# Altium schematic sheet FMC_DAC_125M_14B_16CHA.SchDoc: Shuttler
size 420 x 297 mm; Author: G.Kasprowicz; CompanyName: WUT ISE; DrawnBy: G.Kasprowicz; Organization: WUT ISE; Address1: PW ISE; Address2: Nowowiejska 15/19 00-665 Warsaw; Address3: gkasprow@gmail.com; DocumentNumber: 1; Revision: 2; SheetNumber: 1; SheetTotal: 10; ModifiedBy: -; CheckedDate: -; Title2: FMC DAC 125M 14B 16cha; DivGrp: WUT ISE; Designer: G.Kasprowicz; ModifiedDate: -; ProjectName: Sensor Box
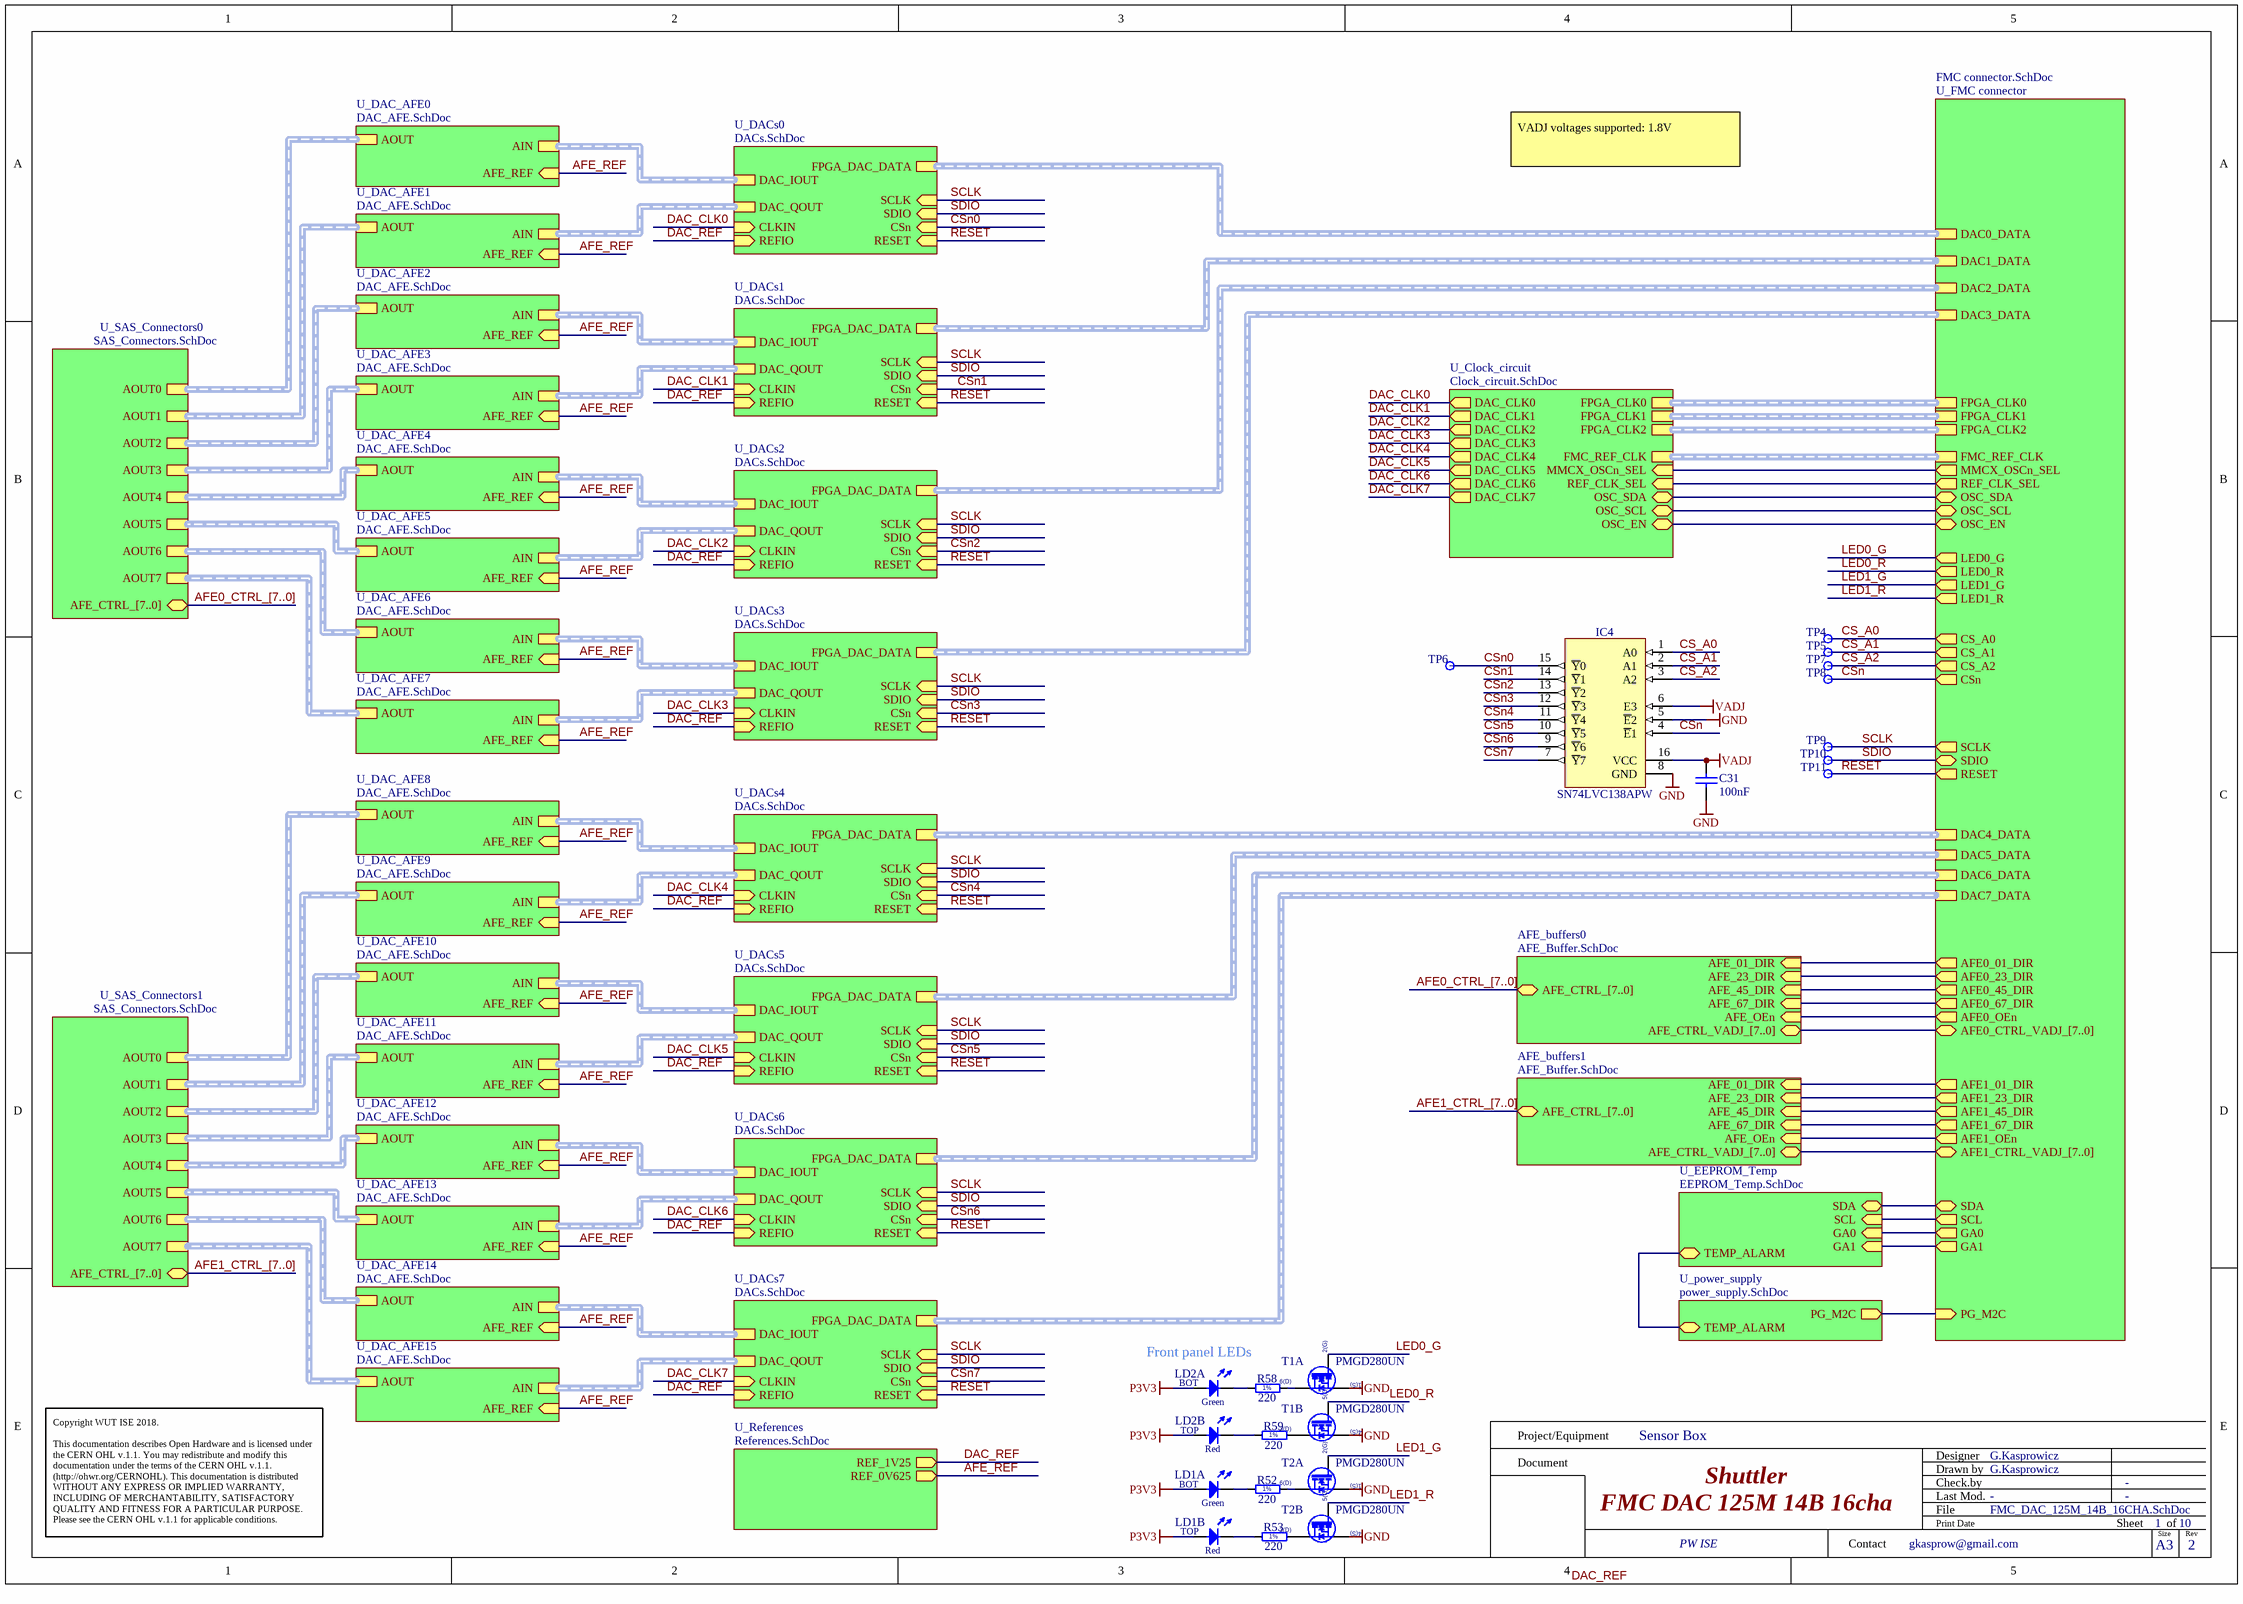
[diagram p0: FMC_DAC_125M_14B_16CHA.SchDoc]

## Parts
C31  100nF  [CAPC1005X55N]
IC4  SN74LVC138APW  [SOP65P640X110-16N]
LD1  Red/Green  [LED_DIALIGHT_571-0112F]  (value not drawn)  (parts A,B of 2)
LD2  Red/Green  [LED_DIALIGHT_571-0112F]  (value not drawn)  (parts A,B of 2)
R52  220  [RESC1608X55N]
R53  220  [RESC1608X55N]
R58  220  [RESC1608X55N]
R59  220  [RESC1608X55N]
T1  PMGD280UN  [SOT65P210X110-6N]  (parts A,B of 2)
T2  PMGD280UN  [SOT65P210X110-6N]  (parts A,B of 2)
TP4  Test Point  [TPS127]  (value not drawn)
TP5  Test Point  [TPS127]  (value not drawn)
TP6  Test Point  [TPS127]  (value not drawn)
TP7  Test Point  [TPS127]  (value not drawn)
TP8  Test Point  [TPS127]  (value not drawn)
TP9  Test Point  [TPS127]  (value not drawn)
TP10  Test Point  [TPS127]  (value not drawn)
TP11  Test Point  [TPS127]  (value not drawn)

## Sub-sheets
AFE_buffers0 = AFE_Buffer.SchDoc: AFE_CTRL_[7..0] (bidir), AFE_23_DIR (in), AFE_67_DIR (in), AFE_01_DIR (in), AFE_OEn (in), AFE_45_DIR (in), AFE_CTRL_VADJ_[7..0] (bidir)
AFE_buffers1 = AFE_Buffer.SchDoc: AFE_CTRL_[7..0] (bidir), AFE_23_DIR (in), AFE_67_DIR (in), AFE_01_DIR (in), AFE_OEn (in), AFE_45_DIR (in), AFE_CTRL_VADJ_[7..0] (bidir)
U_Clock_circuit = Clock_circuit.SchDoc: FPGA_CLK0 (harness DIFFCLK), FPGA_CLK1 (harness DIFFCLK), FPGA_CLK2 (harness DIFFCLK), DAC_CLK0 (out), DAC_CLK1 (out), DAC_CLK2 (out), DAC_CLK3 (out), DAC_CLK4 (out), DAC_CLK5 (out), DAC_CLK6 (out), DAC_CLK7 (out), OSC_SDA (bidir), OSC_SCL (bidir), OSC_EN (bidir), MMCX_OSCn_SEL (in), FMC_REF_CLK (harness DIFFCLK), REF_CLK_SEL (in)
U_DAC_AFE0 = DAC_AFE.SchDoc: AIN (harness DIFF), AOUT (harness DIFF), AFE_REF (in)
U_DAC_AFE1 = DAC_AFE.SchDoc: AIN (harness DIFF), AOUT (harness DIFF), AFE_REF (in)
U_DAC_AFE2 = DAC_AFE.SchDoc: AIN (harness DIFF), AOUT (harness DIFF), AFE_REF (in)
U_DAC_AFE3 = DAC_AFE.SchDoc: AIN (harness DIFF), AOUT (harness DIFF), AFE_REF (in)
U_DAC_AFE4 = DAC_AFE.SchDoc: AIN (harness DIFF), AOUT (harness DIFF), AFE_REF (in)
U_DAC_AFE5 = DAC_AFE.SchDoc: AIN (harness DIFF), AOUT (harness DIFF), AFE_REF (in)
U_DAC_AFE6 = DAC_AFE.SchDoc: AIN (harness DIFF), AOUT (harness DIFF), AFE_REF (in)
U_DAC_AFE7 = DAC_AFE.SchDoc: AIN (harness DIFF), AOUT (harness DIFF), AFE_REF (in)
U_DAC_AFE8 = DAC_AFE.SchDoc: AIN (harness DIFF), AOUT (harness DIFF), AFE_REF (in)
U_DAC_AFE9 = DAC_AFE.SchDoc: AIN (harness DIFF), AOUT (harness DIFF), AFE_REF (in)
U_DAC_AFE10 = DAC_AFE.SchDoc: AIN (harness DIFF), AOUT (harness DIFF), AFE_REF (in)
U_DAC_AFE11 = DAC_AFE.SchDoc: AIN (harness DIFF), AOUT (harness DIFF), AFE_REF (in)
U_DAC_AFE12 = DAC_AFE.SchDoc: AIN (harness DIFF), AOUT (harness DIFF), AFE_REF (in)
U_DAC_AFE13 = DAC_AFE.SchDoc: AIN (harness DIFF), AOUT (harness DIFF), AFE_REF (in)
U_DAC_AFE14 = DAC_AFE.SchDoc: AIN (harness DIFF), AOUT (harness DIFF), AFE_REF (in)
U_DAC_AFE15 = DAC_AFE.SchDoc: AIN (harness DIFF), AOUT (harness DIFF), AFE_REF (in)
U_DACs0 = DACs.SchDoc: FPGA_DAC_DATA (harness DAC_DATA_E), SCLK (in), SDIO (in), CSn (in), RESET (in), DAC_IOUT (harness DIFF), DAC_QOUT (harness DIFF), CLKIN (in), REFIO (in)
U_DACs1 = DACs.SchDoc: FPGA_DAC_DATA (harness DAC_DATA_E), SCLK (in), SDIO (in), CSn (in), RESET (in), DAC_IOUT (harness DIFF), DAC_QOUT (harness DIFF), CLKIN (in), REFIO (in)
U_DACs2 = DACs.SchDoc: FPGA_DAC_DATA (harness DAC_DATA_E), SCLK (in), SDIO (in), CSn (in), RESET (in), DAC_IOUT (harness DIFF), DAC_QOUT (harness DIFF), CLKIN (in), REFIO (in)
U_DACs3 = DACs.SchDoc: FPGA_DAC_DATA (harness DAC_DATA_E), SCLK (in), SDIO (in), CSn (in), RESET (in), DAC_IOUT (harness DIFF), DAC_QOUT (harness DIFF), CLKIN (in), REFIO (in)
U_DACs4 = DACs.SchDoc: FPGA_DAC_DATA (harness DAC_DATA_E), SCLK (in), SDIO (in), CSn (in), RESET (in), DAC_IOUT (harness DIFF), DAC_QOUT (harness DIFF), CLKIN (in), REFIO (in)
U_DACs5 = DACs.SchDoc: FPGA_DAC_DATA (harness DAC_DATA_E), SCLK (in), SDIO (in), CSn (in), RESET (in), DAC_IOUT (harness DIFF), DAC_QOUT (harness DIFF), CLKIN (in), REFIO (in)
U_DACs6 = DACs.SchDoc: FPGA_DAC_DATA (harness DAC_DATA_E), SCLK (in), SDIO (in), CSn (in), RESET (in), DAC_IOUT (harness DIFF), DAC_QOUT (harness DIFF), CLKIN (in), REFIO (in)
U_DACs7 = DACs.SchDoc: FPGA_DAC_DATA (harness DAC_DATA_E), SCLK (in), SDIO (in), CSn (in), RESET (in), DAC_IOUT (harness DIFF), DAC_QOUT (harness DIFF), CLKIN (in), REFIO (in)
U_EEPROM_Temp = EEPROM_Temp.SchDoc: SDA (bidir), SCL (in), GA0 (in), GA1 (in), TEMP_ALARM (bidir)
U_FMC connector = FMC connector.SchDoc: SDA (bidir), GA1 (out), GA0 (out), SCL (out), CS_A2 (out), CSn (out), CS_A0 (out), CS_A1 (out), SCLK (out), SDIO (bidir), RESET (out), DAC4_DATA (harness DAC_DATA_E), DAC5_DATA (harness DAC_DATA_E), DAC6_DATA (harness DAC_DATA_E), DAC7_DATA (harness DAC_DATA_E), DAC1_DATA (harness DAC_DATA_E), DAC2_DATA (harness DAC_DATA_E), DAC3_DATA (harness DAC_DATA_E), DAC0_DATA (harness DAC_DATA_E), FPGA_CLK0 (harness DIFF), FPGA_CLK1 (harness DIFF), FPGA_CLK2 (harness DIFF), FMC_REF_CLK (harness DIFF), MMCX_OSCn_SEL (out), REF_CLK_SEL (out), OSC_SDA (bidir), OSC_SCL (bidir), OSC_EN (bidir), AFE0_01_DIR (out), AFE0_23_DIR (out), AFE0_45_DIR (out), AFE0_67_DIR (out), AFE0_OEn (out), AFE0_CTRL_VADJ_[7..0] (bidir), AFE1_CTRL_VADJ_[7..0] (bidir), AFE1_01_DIR (out), AFE1_23_DIR (out), AFE1_45_DIR (out), AFE1_67_DIR (out), AFE1_OEn (out), PG_M2C (in), LED0_G (out), LED0_R (out), LED1_G (out), LED1_R (out)
U_power_supply = power_supply.SchDoc: PG_M2C (out), TEMP_ALARM (bidir)
U_References = References.SchDoc: REF_1V25 (out), REF_0V625 (out)
U_SAS_Connectors0 = SAS_Connectors.SchDoc: AOUT4 (harness DIFF), AOUT0 (harness DIFF), AOUT1 (harness DIFF), AOUT2 (harness DIFF), AOUT6 (harness DIFF), AOUT7 (harness DIFF), AFE_CTRL_[7..0] (bidir), AOUT3 (harness DIFF), AOUT5 (harness DIFF)
U_SAS_Connectors1 = SAS_Connectors.SchDoc: AOUT4 (harness DIFF), AOUT0 (harness DIFF), AOUT1 (harness DIFF), AOUT2 (harness DIFF), AOUT6 (harness DIFF), AOUT7 (harness DIFF), AOUT3 (harness DIFF), AOUT5 (harness DIFF), AFE_CTRL_[7..0] (bidir)

## Nets
GND: C31.1 IC4.5(~{E}2) IC4.8(GND) T1.1(S) T1.4(S) T2.1(S) T2.4(S)
P3V3: LD1.2(A) LD1.4(A) LD2.2(A) LD2.4(A)
VADJ: C31.2 IC4.6(E3) IC4.16(VCC)
AFE_REF: sheet U_DAC_AFE0/AFE_REF, sheet U_DAC_AFE1/AFE_REF, sheet U_DAC_AFE2/AFE_REF, sheet U_DAC_AFE3/AFE_REF, sheet U_DAC_AFE4/AFE_REF, sheet U_DAC_AFE5/AFE_REF, sheet U_DAC_AFE6/AFE_REF, sheet U_DAC_AFE7/AFE_REF, sheet U_DAC_AFE8/AFE_REF, sheet U_DAC_AFE9/AFE_REF, sheet U_DAC_AFE10/AFE_REF, sheet U_DAC_AFE11/AFE_REF, sheet U_DAC_AFE12/AFE_REF, sheet U_DAC_AFE13/AFE_REF, sheet U_DAC_AFE14/AFE_REF, sheet U_DAC_AFE15/AFE_REF, sheet U_References/REF_0V625
CS_A0: IC4.1(A0) TP4.1 ; sheet U_FMC connector/CS_A0
CS_A1: IC4.2(A1) TP5.1 ; sheet U_FMC connector/CS_A1
CS_A2: IC4.3(A2) TP7.1 ; sheet U_FMC connector/CS_A2
CSn: IC4.4(~{E}1) TP8.1 ; sheet U_FMC connector/CSn
CSn0: IC4.15(~{Y}0) TP6.1 ; sheet U_DACs0/CSn
CSn1: IC4.14(~{Y}1) ; sheet U_DACs1/CSn
CSn2: IC4.13(~{Y}2) ; sheet U_DACs2/CSn
CSn3: IC4.12(~{Y}3) ; sheet U_DACs3/CSn
CSn4: IC4.11(~{Y}4) ; sheet U_DACs4/CSn
CSn5: IC4.10(~{Y}5) ; sheet U_DACs5/CSn
CSn6: IC4.9(~{Y}6) ; sheet U_DACs6/CSn
CSn7: IC4.7(~{Y}7) ; sheet U_DACs7/CSn
DAC_CLK0: sheet U_DACs0/CLKIN, sheet U_Clock_circuit/DAC_CLK0
DAC_CLK1: sheet U_DACs1/CLKIN, sheet U_Clock_circuit/DAC_CLK1
DAC_CLK2: sheet U_DACs2/CLKIN, sheet U_Clock_circuit/DAC_CLK2
DAC_CLK3: sheet U_DACs3/CLKIN, sheet U_Clock_circuit/DAC_CLK3
DAC_CLK4: sheet U_DACs4/CLKIN, sheet U_Clock_circuit/DAC_CLK4
DAC_CLK5: sheet U_DACs5/CLKIN, sheet U_Clock_circuit/DAC_CLK5
DAC_CLK6: sheet U_DACs6/CLKIN, sheet U_Clock_circuit/DAC_CLK6
DAC_CLK7: sheet U_DACs7/CLKIN, sheet U_Clock_circuit/DAC_CLK7
DAC_REF: sheet U_DACs0/REFIO, sheet U_DACs1/REFIO, sheet U_DACs2/REFIO, sheet U_DACs3/REFIO, sheet U_DACs4/REFIO, sheet U_DACs5/REFIO, sheet U_DACs6/REFIO, sheet U_DACs7/REFIO, sheet U_References/REF_1V25
LED0_G: T1.2(G) ; sheet U_FMC connector/LED0_G
LED0_R: T1.5(G) ; sheet U_FMC connector/LED0_R
LED1_G: T2.2(G) ; sheet U_FMC connector/LED1_G
LED1_R: T2.5(G) ; sheet U_FMC connector/LED1_R
RESET: TP11.1 ; sheet U_FMC connector/RESET, sheet U_DACs0/RESET, sheet U_DACs1/RESET, sheet U_DACs2/RESET, sheet U_DACs3/RESET, sheet U_DACs4/RESET, sheet U_DACs5/RESET, sheet U_DACs6/RESET, sheet U_DACs7/RESET
SCLK: TP9.1 ; sheet U_FMC connector/SCLK, sheet U_DACs0/SCLK, sheet U_DACs1/SCLK, sheet U_DACs2/SCLK, sheet U_DACs3/SCLK, sheet U_DACs4/SCLK, sheet U_DACs5/SCLK, sheet U_DACs6/SCLK, sheet U_DACs7/SCLK
SDIO: TP10.1 ; sheet U_FMC connector/SDIO, sheet U_DACs0/SDIO, sheet U_DACs1/SDIO, sheet U_DACs2/SDIO, sheet U_DACs3/SDIO, sheet U_DACs4/SDIO, sheet U_DACs5/SDIO, sheet U_DACs6/SDIO, sheet U_DACs7/SDIO
NetLD1_1: LD1.1(C) R52.1
NetLD1_3: LD1.3(C) R53.1
NetLD2_1: LD2.1(C) R58.1
NetLD2_3: LD2.3(C) R59.1
NetR52_2: R52.2 T2.6(D)
NetR53_2: R53.2 T2.3(D)
NetR58_2: R58.2 T1.6(D)
NetR59_2: R59.2 T1.3(D)
(unnamed): sheet U_EEPROM_Temp/SDA, sheet U_FMC connector/SDA
(unnamed): sheet U_EEPROM_Temp/SCL, sheet U_FMC connector/SCL
(unnamed): sheet U_EEPROM_Temp/GA0, sheet U_FMC connector/GA0
(unnamed): sheet U_EEPROM_Temp/GA1, sheet U_FMC connector/GA1
(unnamed): sheet U_EEPROM_Temp/TEMP_ALARM, sheet U_power_supply/TEMP_ALARM
(unnamed): sheet U_FMC connector/MMCX_OSCn_SEL, sheet U_Clock_circuit/MMCX_OSCn_SEL
(unnamed): sheet U_FMC connector/REF_CLK_SEL, sheet U_Clock_circuit/REF_CLK_SEL
(unnamed): sheet U_FMC connector/OSC_SDA, sheet U_Clock_circuit/OSC_SDA
(unnamed): sheet U_FMC connector/OSC_SCL, sheet U_Clock_circuit/OSC_SCL
(unnamed): sheet U_FMC connector/OSC_EN, sheet U_Clock_circuit/OSC_EN
(unnamed): sheet U_FMC connector/AFE0_01_DIR, sheet AFE_buffers0/AFE_01_DIR
(unnamed): sheet U_FMC connector/AFE0_23_DIR, sheet AFE_buffers0/AFE_23_DIR
(unnamed): sheet U_FMC connector/AFE0_45_DIR, sheet AFE_buffers0/AFE_45_DIR
(unnamed): sheet U_FMC connector/AFE0_67_DIR, sheet AFE_buffers0/AFE_67_DIR
(unnamed): sheet U_FMC connector/AFE0_OEn, sheet AFE_buffers0/AFE_OEn
(unnamed): sheet U_FMC connector/AFE1_01_DIR, sheet AFE_buffers1/AFE_01_DIR
(unnamed): sheet U_FMC connector/AFE1_23_DIR, sheet AFE_buffers1/AFE_23_DIR
(unnamed): sheet U_FMC connector/AFE1_45_DIR, sheet AFE_buffers1/AFE_45_DIR
(unnamed): sheet U_FMC connector/AFE1_67_DIR, sheet AFE_buffers1/AFE_67_DIR
(unnamed): sheet U_FMC connector/AFE1_OEn, sheet AFE_buffers1/AFE_OEn
(unnamed): sheet U_FMC connector/PG_M2C, sheet U_power_supply/PG_M2C

## Buses and harness runs
bus AFE0_CTRL_[7..0] = sheet AFE_buffers0/AFE_CTRL_[7..0]
bus AFE0_CTRL_[7..0] = sheet U_SAS_Connectors0/AFE_CTRL_[7..0]
bus AFE1_CTRL_[7..0] = sheet AFE_buffers1/AFE_CTRL_[7..0]
bus AFE1_CTRL_[7..0] = sheet U_SAS_Connectors1/AFE_CTRL_[7..0]
bus sheet AFE_buffers0/AFE_CTRL_VADJ_[7..0] = sheet U_FMC connector/AFE0_CTRL_VADJ_[7..0]
bus sheet AFE_buffers1/AFE_CTRL_VADJ_[7..0] = sheet U_FMC connector/AFE1_CTRL_VADJ_[7..0]
harness sheet U_Clock_circuit/FMC_REF_CLK = sheet U_FMC connector/FMC_REF_CLK
harness sheet U_Clock_circuit/FPGA_CLK0 = sheet U_FMC connector/FPGA_CLK0
harness sheet U_Clock_circuit/FPGA_CLK1 = sheet U_FMC connector/FPGA_CLK1
harness sheet U_Clock_circuit/FPGA_CLK2 = sheet U_FMC connector/FPGA_CLK2
harness sheet U_DAC_AFE0/AIN = sheet U_DACs0/DAC_IOUT
harness sheet U_DAC_AFE0/AOUT = sheet U_SAS_Connectors0/AOUT0
harness sheet U_DAC_AFE1/AIN = sheet U_DACs0/DAC_QOUT
harness sheet U_DAC_AFE1/AOUT = sheet U_SAS_Connectors0/AOUT1
harness sheet U_DAC_AFE2/AIN = sheet U_DACs1/DAC_IOUT
harness sheet U_DAC_AFE2/AOUT = sheet U_SAS_Connectors0/AOUT2
harness sheet U_DAC_AFE3/AIN = sheet U_DACs1/DAC_QOUT
harness sheet U_DAC_AFE3/AOUT = sheet U_SAS_Connectors0/AOUT3
harness sheet U_DAC_AFE4/AIN = sheet U_DACs2/DAC_IOUT
harness sheet U_DAC_AFE4/AOUT = sheet U_SAS_Connectors0/AOUT4
harness sheet U_DAC_AFE5/AIN = sheet U_DACs2/DAC_QOUT
harness sheet U_DAC_AFE5/AOUT = sheet U_SAS_Connectors0/AOUT5
harness sheet U_DAC_AFE6/AIN = sheet U_DACs3/DAC_IOUT
harness sheet U_DAC_AFE6/AOUT = sheet U_SAS_Connectors0/AOUT6
harness sheet U_DAC_AFE7/AIN = sheet U_DACs3/DAC_QOUT
harness sheet U_DAC_AFE7/AOUT = sheet U_SAS_Connectors0/AOUT7
harness sheet U_DAC_AFE8/AIN = sheet U_DACs4/DAC_IOUT
harness sheet U_DAC_AFE8/AOUT = sheet U_SAS_Connectors1/AOUT0
harness sheet U_DAC_AFE9/AIN = sheet U_DACs4/DAC_QOUT
harness sheet U_DAC_AFE9/AOUT = sheet U_SAS_Connectors1/AOUT1
harness sheet U_DAC_AFE10/AIN = sheet U_DACs5/DAC_IOUT
harness sheet U_DAC_AFE10/AOUT = sheet U_SAS_Connectors1/AOUT2
harness sheet U_DAC_AFE11/AIN = sheet U_DACs5/DAC_QOUT
harness sheet U_DAC_AFE11/AOUT = sheet U_SAS_Connectors1/AOUT3
harness sheet U_DAC_AFE12/AIN = sheet U_DACs6/DAC_IOUT
harness sheet U_DAC_AFE12/AOUT = sheet U_SAS_Connectors1/AOUT4
harness sheet U_DAC_AFE13/AIN = sheet U_DACs6/DAC_QOUT
harness sheet U_DAC_AFE13/AOUT = sheet U_SAS_Connectors1/AOUT5
harness sheet U_DAC_AFE14/AIN = sheet U_DACs7/DAC_IOUT
harness sheet U_DAC_AFE14/AOUT = sheet U_SAS_Connectors1/AOUT6
harness sheet U_DAC_AFE15/AIN = sheet U_DACs7/DAC_QOUT
harness sheet U_DAC_AFE15/AOUT = sheet U_SAS_Connectors1/AOUT7
harness sheet U_DACs0/FPGA_DAC_DATA = sheet U_FMC connector/DAC0_DATA
harness sheet U_DACs1/FPGA_DAC_DATA = sheet U_FMC connector/DAC1_DATA
harness sheet U_DACs2/FPGA_DAC_DATA = sheet U_FMC connector/DAC2_DATA
harness sheet U_DACs3/FPGA_DAC_DATA = sheet U_FMC connector/DAC3_DATA
harness sheet U_DACs4/FPGA_DAC_DATA = sheet U_FMC connector/DAC4_DATA
harness sheet U_DACs5/FPGA_DAC_DATA = sheet U_FMC connector/DAC5_DATA
harness sheet U_DACs6/FPGA_DAC_DATA = sheet U_FMC connector/DAC6_DATA
harness sheet U_DACs7/FPGA_DAC_DATA = sheet U_FMC connector/DAC7_DATA

## Notes on the sheet
- VADJ voltages supported: 1.8V
- Front panel LEDs
- Labels drawn without touching a wire or pin: DAC_REF
- Project/Equipment
- Document
- Designer
- Drawn by
- Check.by
- Copyright WUT ISE 2018.
  This documentation describes Open Hardware and is licensed under the CERN OHL v.1.1. You may redistribute and modify this documentation under the terms of the CERN OHL v.1.1. (http://ohwr.org/CERNOHL). This documentation is distributed WITHOUT ANY EXPRESS OR IMPLIED WARRANTY, INCLUDING OF MERCHANTABILITY, SATISFACTORY QUALITY AND FITNESS FOR A PARTICULAR PURPOSE. Please see the CERN OHL v.1.1 for applicable conditions.
- Contact
- File
- Last Mod.
- Print Date
- Sheet
- Size
- A3
- of
- Rev
- (in symbol LED_DIALIGHT_571-0112F, part A) BOT; Green
- (in symbol LED_DIALIGHT_571-0112F, part B) TOP; Red
- (in symbol PMGD280UN, part A) 2(G); 1(S); 6(D)
- (in symbol PMGD280UN, part B) 5(G); 4(S); 3(D)
- (in symbol R0603_220R_1%_0.1W_100PPM) 1%

## Library data of the parts
C31 = CC0402_100NF_16V_10%_X5R: Non-polarised capacitor; Part Description: SMD Multilayer Chip Ceramic Capacitor; Manufacturer: GENERIC; Manufacturer1 Part Number: GRM155R61C104KA88D; Voltage: 16V; TC: X5R; Tolerance: ±10%; Part Number: CC0402_100NF_16V_10%_X5R; Component Kind: Standard; Component Type: Standard; Pin Count: 2; Value: 100nF; Status: None; Manufacturer Part Number: CC0402_100NF_16V_10%_X5R; Case: 0402; Mounted: Yes; Socket: No; SMD: Yes; Sense: No; Manufacturer1 Example: MURATA; Manufacturer1 ComponentHeight: 0.55mm; HelpURL: \\cern.ch\dfs\Applications\Altium\Datasheets\CC0402_X5R_MURATA_GRM.pdf; Author: CERN DEM JLC; CreateDate: 10.12.2013; LatestRevisionDate: 10.12.2013
IC4 = SN74LVC138APW: 3-Line to 8-Line Decoder/Demultiplexer; Part Description: 3-Line to 8-Line Decoder/Demultiplexer, Inverting; Manufacturer: Texas Instruments; PressFit: No; Bonding: No; Part Number: SN74LVC138APW; Component Kind: Standard; Component Type: Standard; Device: SN74LVC138APW; PackageDescription: SOP, 0.65mm pitch; 16 pin, 4.40mm W X 5.00mm L X 1.10mm H body IPC Medium Density; Manufacturer Part Number: SN74LVC138APW; Pin Count: 16; Case: TSSOP16; Mounted: Yes; Socket: No; SMD: Yes; Sense: No; ComponentHeight: 1.1mm; Author: GK; HelpURL: \\cern.ch\dfs\Applications\Altium\Datasheets\74HC138PW.pdf; CreateDate: 09/06/2015; LatestRevisionDate: 09/06/2015
LD1 LD2 = LED_DIALIGHT_571-0112F: 2x LED  Botom Green, Top Red; Part Description: Dual 2mm  LEDs, Red Top,Green Bot, CBI® Circuit Board Indicator (Without positioning pins); PressFit: No; Bonding: No; Part Number: LED_DIALIGHT_571-0112F; Component Kind: Standard; Component Type: Standard; Color: Red/Green; PackageDescription: 2x 2mm LED (Top: Red, Bot: Green) PCB Edge Mounting (Without positioning pins) DIALIGHT 571 Serie; Manufacturer: DIALIGHT; Manufacturer Part Number: 571-0112F; Pin Count: 4; Mounted: Yes; Socket: No; SMD: No; Sense: No; ComponentHeight: 8.6mm; HelpURL: \\cern.ch\dfs\Applications\Altium\Datasheets\LED_DIALIGHT_571-0112F.pdf; Author: CERN DEM JLC; CreateDate: 09/11/2009; LatestRevisionDate: 17/03/2010
R52 R53 R58 R59 = R0603_220R_1%_0.1W_100PPM: Resistor - 1%; Part Description: General Purpose Thick Film Chip Resistor; Manufacturer: GENERIC; Manufacturer1 Part Number: NRC06F2200TRF; Power: 0.1W; TC: ±100ppm/°C; Part Number: R0603_220R_1%_0.1W_100PPM; Component Kind: Standard; Component Type: Standard; Pin Count: 2; Value: 220; Status: Preferred; Tolerance: ±1%; Manufacturer Part Number: R0603_220R_1%_0.1W_100PPM; Case: 0603; Mounted: Yes; Sense: No; Socket: No; SMD: Yes; Manufacturer1 Example: NIC COMPONENT; Manufacturer1 ComponentHeight: 0.55mm; HelpURL: \\cern.ch\dfs\Applications\Altium\Datasheets\R0603_NIC_NRC.pdf; Author: CERN DEM JLC; CreateDate: 03.12.2007; LatestRevisionDate: 13.03.2008
T1 T2 = PMGD280UN: Dual N-Channel micro TrenchMOS™ Ultra Low Level FET; Part Description: 20V 870mA Dual N-Channel micro TrenchMOS™ Ultra Low Level FET; Manufacturer: NXP SEMICONDUCTORS; PressFit: No; Bonding: No; Part Number: PMGD280UN; Component Kind: Standard; Component Type: Standard; Device: PMGD280UN; PackageDescription: SOT363, SC70-6, SOT, 0.65mm Pitch, 6 pin, 1.25mm W X 2.00mm L X 1.10mm H, IPC Medium Density; Manufacturer Part Number: PMGD280UN; Pin Count: 6; Case: SOT363; Mounted: Yes; Socket: No; SMD: Yes; Sense: No; ComponentHeight: 1.1mm; HelpURL: \\cern.ch\dfs\Applications\Altium\Datasheets\PMGD280UN.pdf; Author: CERN DEM JLC; CreateDate: 19/11/2014; LatestRevisionDate: 19/11/2014
TP4-TP11 = SMD_PAD_1.27X1.27MM: Part Description: 1.27mm x 1.27mm PCB Copper Area (SMD Test Point); Mounted: No; Part Number: SMD_PAD_1.27X1.27MM; Component Kind: Standard (No BOM); Component Type: Standard (No BOM); Pin Count: 1; Family: Test Point; Socket: No; SMD: Yes; Sense: No; Status: None; ComponentHeight: 0mm; HelpURL: Undefined; Author: CERN DEM JLC; CreateDate: 12.01.2008; LatestRevisionDate: 12.01.2008; PackageDescription: 1.27mm x 1.27mm PCB Copper Area (SMD Test Point)